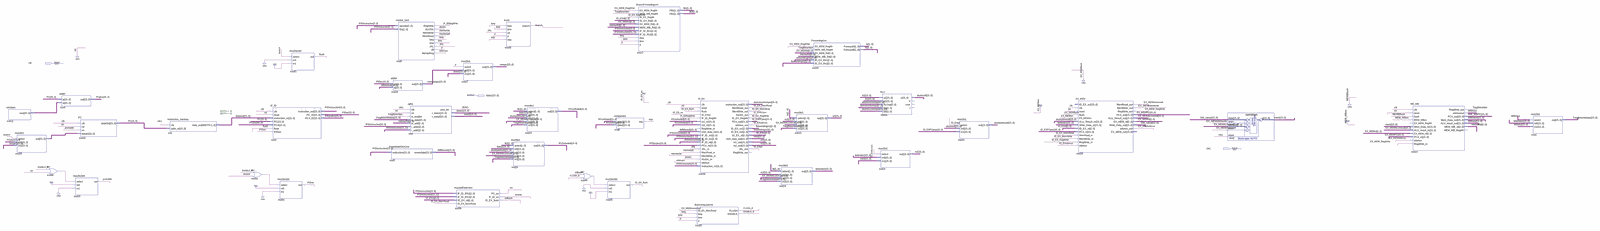
[diagram p0: schematic sheet, whole]
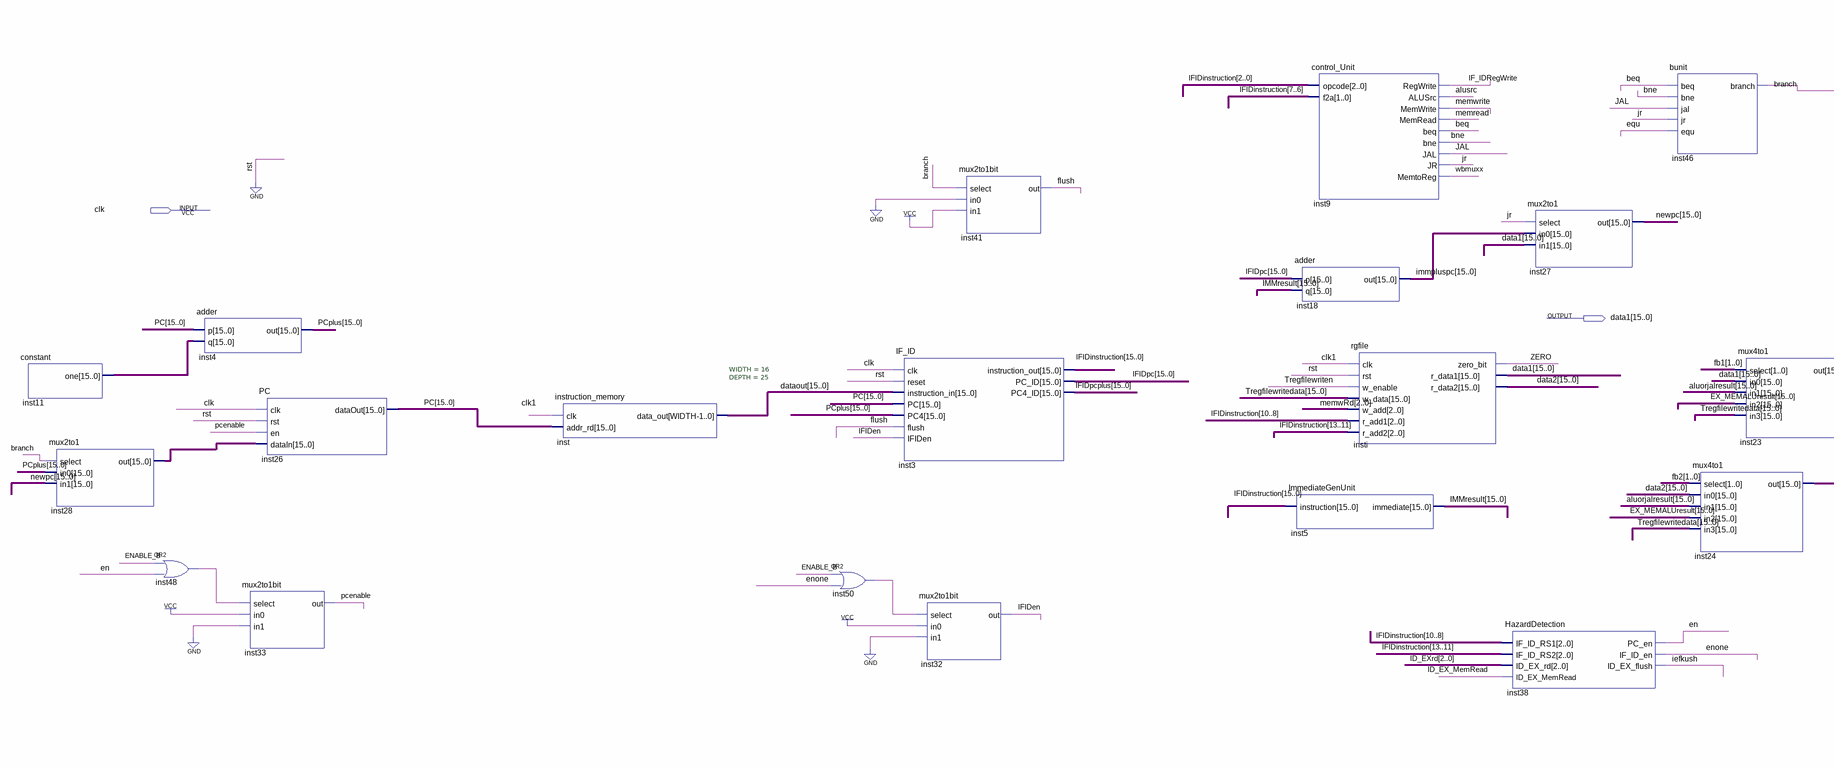
[diagram p1: schematic sheet, left part]
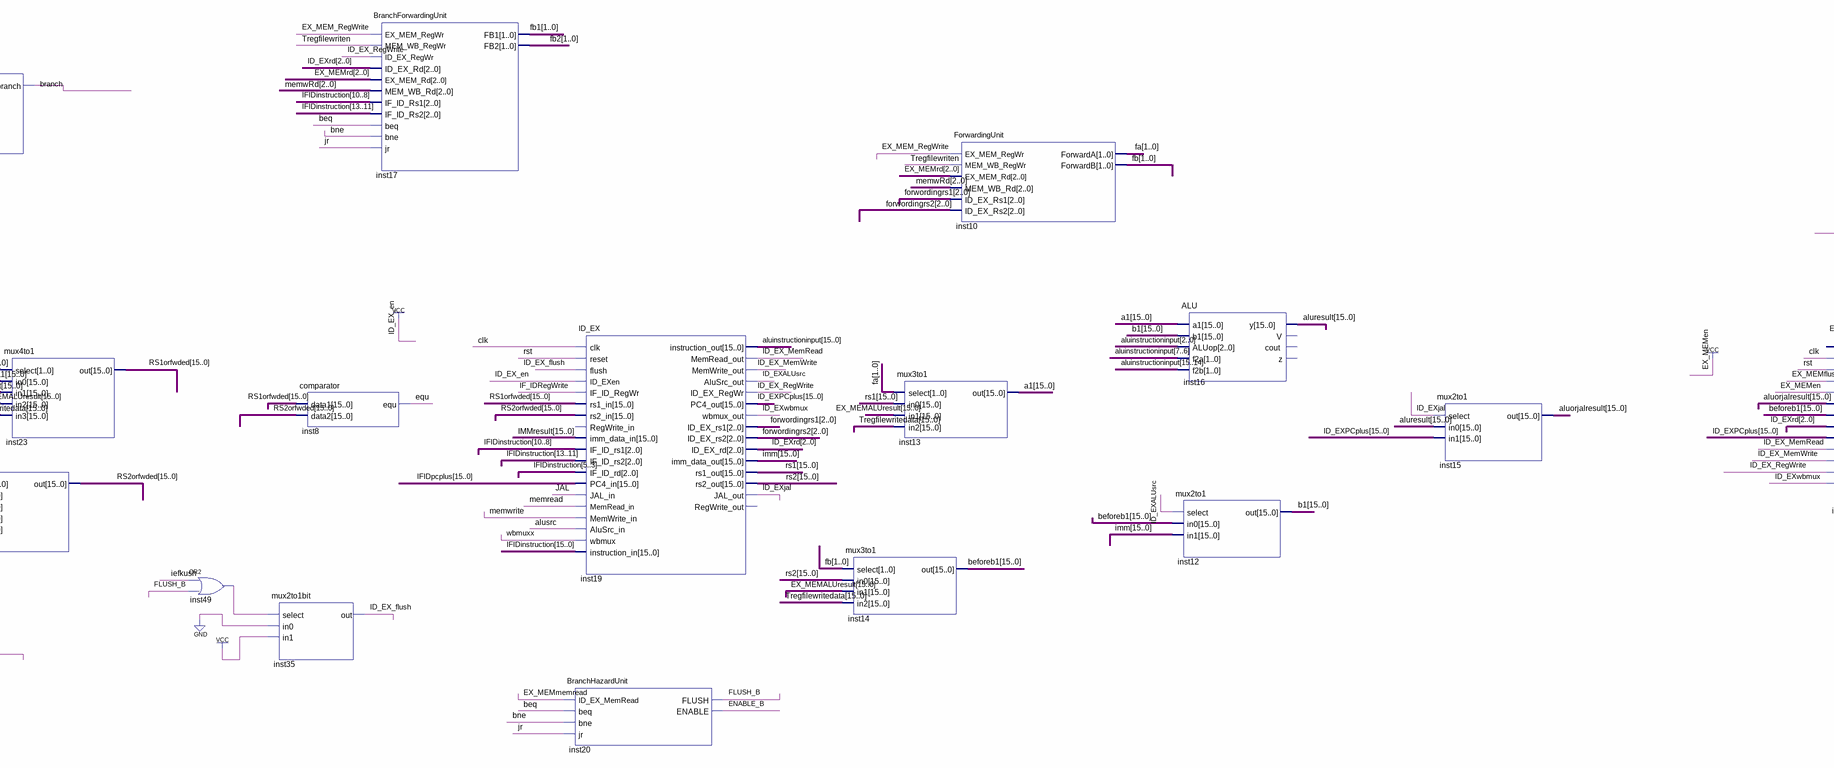
[diagram p2: schematic sheet, centre part]
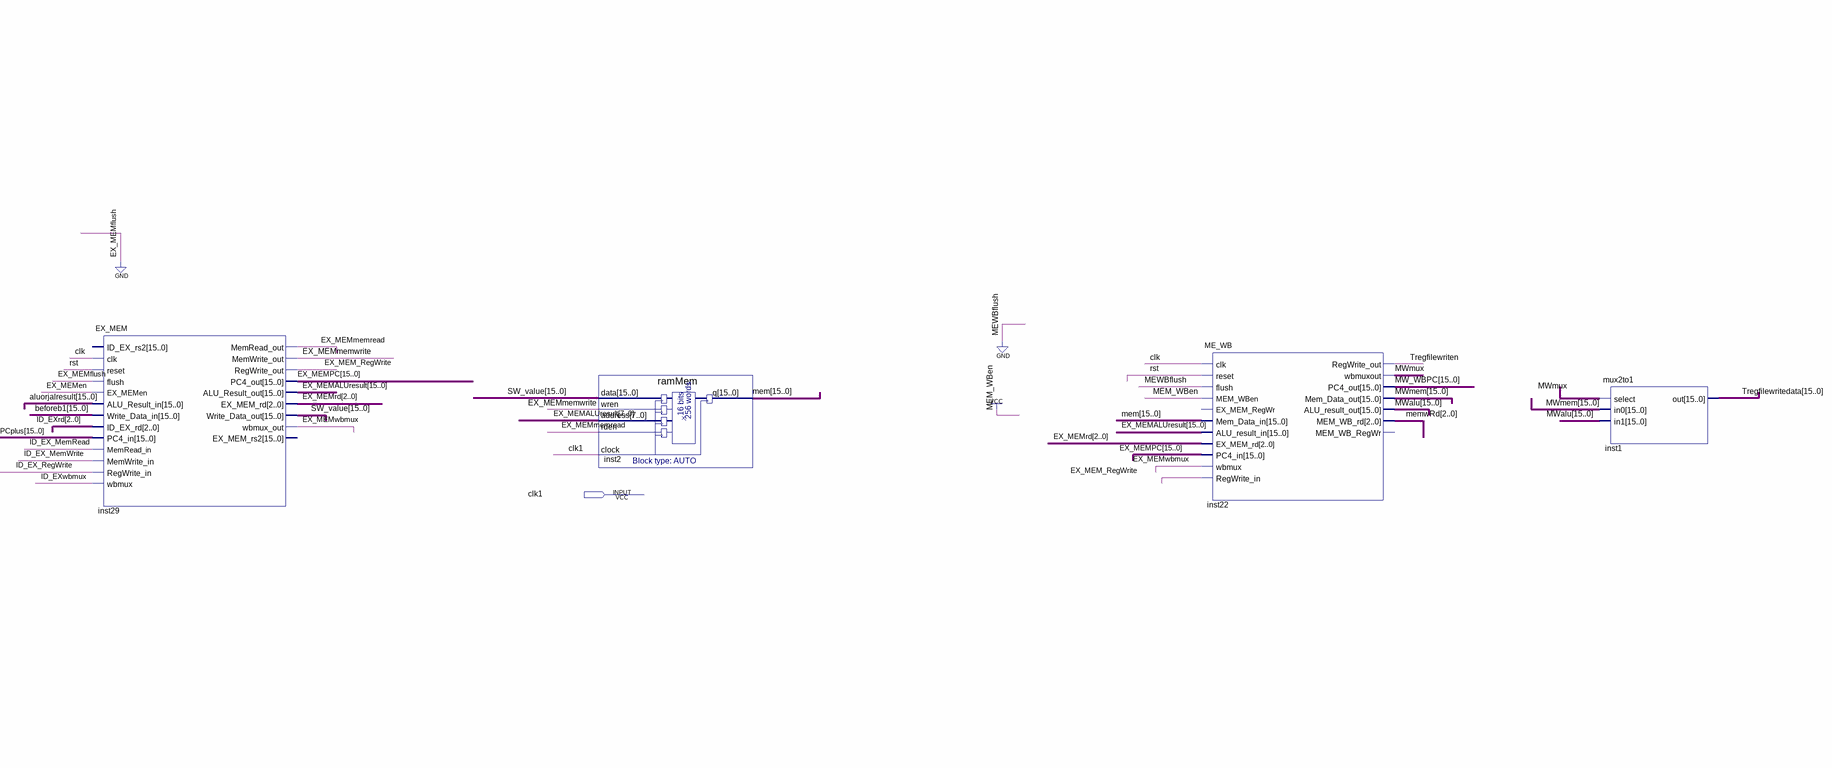
[diagram p3: schematic sheet, right part]
// Quartus schematic Block_proccesor.bdf as structural Verilog: 36 symbols, 3 pins
module Block_proccesor (
  input  clk,
  input  clk1,
  output [15:0] data1
);

  wire alusrc, beq, bne, branch, en, ENABLE_B, enone, equ, EX_MEM_RegWrite, EX_MEMmemread, EX_MEMmemwrite,
       EX_MEMwbmux, flush, FLUSH_B, ID_EX_flush, ID_EX_MemRead, ID_EX_MemWrite, ID_EX_RegWrite, ID_EXALUsrc,
       ID_EXjal, ID_EXwbmux, iefkush, IF_IDRegWrite, IFIDen, inst48_out, inst49_out, inst50_out, JAL, jr,
       memread, memwrite, MWmux, pcenable, Tregfilewriten, wbmuxx, ZERO;
  wire [1:0] fa, fb, fb1, fb2;
  wire [2:0] EX_MEMrd, forwordingrs1, forwordingrs2, ID_EXrd, memwRd;
  wire [15:0] a1, aluinstructioninput, aluorjalresult, aluresult, b1, beforeb1, data2, dataout,
       EX_MEMALUresult, EX_MEMPC, ID_EXPCplus, IFIDinstruction, IFIDpc, IFIDpcplus, imm, immpluspc,
       IMMresult, inst11_one, inst28_out, mem, MW_WBPC, MWalu, MWmem, newpc, PC, PCplus, rs1, RS1orfwded,
       rs2, RS2orfwded, SW_value, Tregfilewritedata;

  constant inst11 (.one(inst11_one));
  mux2to1 inst28 (.select(branch), .in0(PCplus), .in1(newpc), .out(inst28_out));
  or inst48 (inst48_out, ENABLE_B, en);
  adder inst4 (.p(PC), .q(inst11_one), .out(PCplus));
  PC inst26 (.clk(clk), .rst(1'b0), .en(pcenable), .dataIn(inst28_out), .dataOut(PC));
  mux2to1bit inst33 (.select(inst48_out), .in0(1'b1), .in1(1'b0), .out(pcenable));
  instruction_memory #(.WIDTH(16), .DEPTH(25)) inst (.clk(clk1), .addr_rd(PC), .data_out(dataout));
  or inst50 (inst50_out, ENABLE_B, enone);
  IF_ID inst3 (
    .clk(clk), .reset(1'b0), .instruction_in(dataout), .PC(PC), .PC4(PCplus), .flush(flush), .IFIDen(IFIDen),
    .instruction_out(IFIDinstruction), .PC_ID(IFIDpc), .PC4_ID(IFIDpcplus));
  mux2to1bit inst32 (.select(inst50_out), .in0(1'b1), .in1(1'b0), .out(IFIDen));
  mux2to1bit inst41 (.select(branch), .in0(1'b0), .in1(1'b1), .out(flush));
  adder inst18 (.p(IFIDpc), .q(IMMresult), .out(immpluspc));
  ImmediateGenUnit inst5 (.instruction(IFIDinstruction), .immediate(IMMresult));
  control_Unit inst9 (
    .opcode(IFIDinstruction[2:0]), .f2a(IFIDinstruction[7:6]), .RegWrite(IF_IDRegWrite), .ALUSrc(alusrc),
    .MemWrite(memwrite), .MemRead(memread), .beq(beq), .bne(bne), .JAL(JAL), .JR(jr), .MemtoReg(wbmuxx));
  rgfile insti (
    .clk(clk1), .rst(1'b0), .w_enable(Tregfilewriten), .w_data(Tregfilewritedata), .w_add(memwRd),
    .r_add1(IFIDinstruction[10:8]), .r_add2(IFIDinstruction[13:11]), .zero_bit(ZERO), .r_data1(data1),
    .r_data2(data2));
  mux2to1 inst27 (.select(jr), .in0(immpluspc), .in1(data1), .out(newpc));
  HazardDetection inst38 (
    .IF_ID_RS1(IFIDinstruction[10:8]), .IF_ID_RS2(IFIDinstruction[13:11]), .ID_EX_rd(ID_EXrd),
    .ID_EX_MemRead(ID_EX_MemRead), .PC_en(en), .IF_ID_en(enone), .ID_EX_flush(iefkush));
  bunit inst46 (.beq(beq), .bne(bne), .jal(JAL), .jr(jr), .equ(equ), .branch(branch));
  mux4to1 inst24 (
    .select(fb2), .in0(data2), .in1(aluorjalresult), .in2(EX_MEMALUresult), .in3(Tregfilewritedata),
    .out(RS2orfwded));
  mux4to1 inst23 (
    .select(fb1), .in0(data1), .in1(aluorjalresult), .in2(EX_MEMALUresult), .in3(Tregfilewritedata),
    .out(RS1orfwded));
  or inst49 (inst49_out, iefkush, FLUSH_B);
  comparator inst8 (.data1(RS1orfwded), .data2(RS2orfwded), .equ(equ));
  mux2to1bit inst35 (.select(inst49_out), .in0(1'b0), .in1(1'b1), .out(ID_EX_flush));
  BranchForwardingUnit inst17 (
    .EX_MEM_RegWr(EX_MEM_RegWrite), .MEM_WB_RegWr(Tregfilewriten), .ID_EX_RegWr(ID_EX_RegWrite),
    .ID_EX_Rd(ID_EXrd), .EX_MEM_Rd(EX_MEMrd), .MEM_WB_Rd(memwRd), .IF_ID_Rs1(IFIDinstruction[10:8]),
    .IF_ID_Rs2(IFIDinstruction[13:11]), .beq(beq), .bne(bne), .jr(jr), .FB1(fb1), .FB2(fb2));
  BranchHazardUnit inst20 (
    .ID_EX_MemRead(EX_MEMmemread), .beq(beq), .bne(bne), .jr(jr), .FLUSH(FLUSH_B), .ENABLE(ENABLE_B));
  ID_EX inst19 (
    .clk(clk), .reset(1'b0), .flush(ID_EX_flush), .ID_EXen(1'b1), .IF_ID_RegWr(IF_IDRegWrite),
    .rs1_in(RS1orfwded), .rs2_in(RS2orfwded), .imm_data_in(IMMresult), .IF_ID_rs1(IFIDinstruction[10:8]),
    .IF_ID_rs2(IFIDinstruction[13:11]), .IF_ID_rd(IFIDinstruction[5:3]), .PC4_in(IFIDpcplus), .JAL_in(JAL),
    .MemRead_in(memread), .MemWrite_in(memwrite), .AluSrc_in(alusrc), .wbmux(wbmuxx),
    .instruction_in(IFIDinstruction), .instruction_out(aluinstructioninput), .MemRead_out(ID_EX_MemRead),
    .MemWrite_out(ID_EX_MemWrite), .AluSrc_out(ID_EXALUsrc), .ID_EX_RegWr(ID_EX_RegWrite),
    .PC4_out(ID_EXPCplus), .wbmux_out(ID_EXwbmux), .ID_EX_rs1(forwordingrs1), .ID_EX_rs2(forwordingrs2),
    .ID_EX_rd(ID_EXrd), .imm_data_out(imm), .rs1_out(rs1), .rs2_out(rs2), .JAL_out(ID_EXjal));  // open: RegWrite_in, RegWrite_out
  mux3to1 inst14 (.select(fb), .in0(rs2), .in1(EX_MEMALUresult), .in2(Tregfilewritedata), .out(beforeb1));
  mux3to1 inst13 (.select(fa), .in0(rs1), .in1(EX_MEMALUresult), .in2(Tregfilewritedata), .out(a1));
  ForwardingUnit inst10 (
    .EX_MEM_RegWr(EX_MEM_RegWrite), .MEM_WB_RegWr(Tregfilewriten), .EX_MEM_Rd(EX_MEMrd), .MEM_WB_Rd(memwRd),
    .ID_EX_Rs1(forwordingrs1), .ID_EX_Rs2(forwordingrs2), .ForwardA(fa), .ForwardB(fb));
  ALU inst16 (
    .a1(a1), .b1(b1), .ALUop(aluinstructioninput[2:0]), .f2a(aluinstructioninput[7:6]),
    .f2b(aluinstructioninput[15:14]), .y(aluresult));  // open: V, cout, z
  mux2to1 inst12 (.select(ID_EXALUsrc), .in0(beforeb1), .in1(imm), .out(b1));
  mux2to1 inst15 (.select(ID_EXjal), .in0(aluresult), .in1(ID_EXPCplus), .out(aluorjalresult));
  EX_MEM inst29 (
    .clk(clk), .reset(1'b0), .flush(1'b0), .EX_MEMen(1'b1), .ALU_Result_in(aluorjalresult),
    .Write_Data_in(beforeb1), .ID_EX_rd(ID_EXrd), .PC4_in(ID_EXPCplus), .MemRead_in(ID_EX_MemRead),
    .MemWrite_in(ID_EX_MemWrite), .RegWrite_in(ID_EX_RegWrite), .wbmux(ID_EXwbmux),
    .MemRead_out(EX_MEMmemread), .MemWrite_out(EX_MEMmemwrite), .RegWrite_out(EX_MEM_RegWrite),
    .PC4_out(EX_MEMPC), .ALU_Result_out(EX_MEMALUresult), .EX_MEM_rd(EX_MEMrd), .Write_Data_out(SW_value),
    .wbmux_out(EX_MEMwbmux));  // open: ID_EX_rs2, EX_MEM_rs2
  ramMem inst2 (
    .data(SW_value), .wren(EX_MEMmemwrite), .address(EX_MEMALUresult[7:0]), .rden(EX_MEMmemread),
    .clock(clk1), .q(mem));
  ME_WB inst22 (
    .clk(clk), .reset(1'b0), .flush(1'b0), .MEM_WBen(1'b1), .Mem_Data_in(mem),
    .ALU_result_in(EX_MEMALUresult), .EX_MEM_rd(EX_MEMrd), .PC4_in(EX_MEMPC), .wbmux(EX_MEMwbmux),
    .RegWrite_in(EX_MEM_RegWrite), .RegWrite_out(Tregfilewriten), .wbmuxout(MWmux), .PC4_out(MW_WBPC),
    .Mem_Data_out(MWmem), .ALU_result_out(MWalu), .MEM_WB_rd(memwRd));  // open: EX_MEM_RegWr, MEM_WB_RegWr
  mux2to1 inst1 (.select(MWmux), .in0(MWmem), .in1(MWalu), .out(Tregfilewritedata));
endmodule
